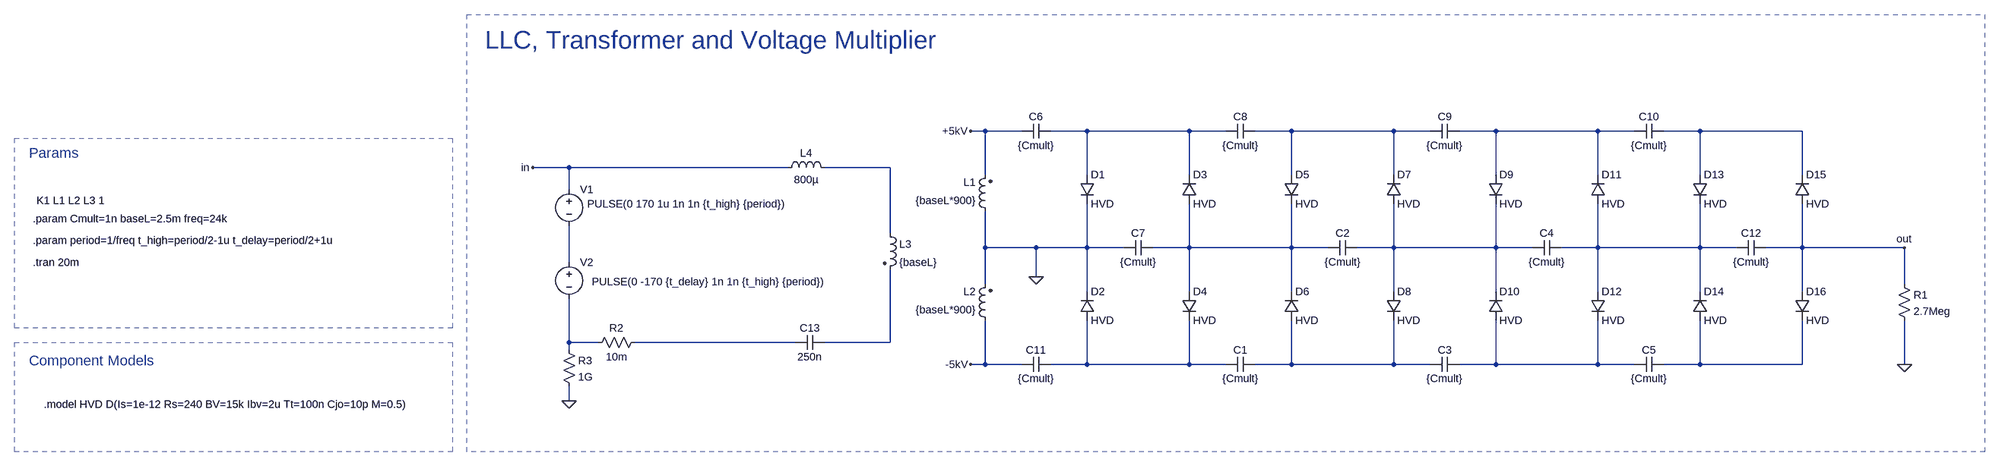
[diagram p0: schematic LLC_Multiplier_tran.asc]
LLC_Multiplier_tran.asc, the LTspice schematic file:
Version 4.1
SHEET 1 1844 1108
WIRE -352 -32 -384 -32
WIRE -272 -32 -352 -32
WIRE -128 -32 -208 -32
WIRE 96 -32 -128 -32
WIRE 176 -32 96 -32
WIRE 320 -32 240 -32
WIRE 544 -32 320 -32
WIRE 624 -32 544 -32
WIRE 768 -32 688 -32
WIRE 992 -32 768 -32
WIRE 1072 -32 992 -32
WIRE 1216 -32 1136 -32
WIRE 1440 -32 1216 -32
WIRE -1264 48 -1344 48
WIRE -784 48 -1264 48
WIRE -560 48 -704 48
WIRE -352 64 -352 -32
WIRE -128 64 -128 -32
WIRE 96 64 96 -32
WIRE 320 64 320 -32
WIRE 544 64 544 -32
WIRE 768 64 768 -32
WIRE 992 64 992 -32
WIRE 1216 64 1216 -32
WIRE 1440 64 1440 -32
WIRE -1264 96 -1264 48
WIRE -560 192 -560 48
WIRE -352 224 -352 144
WIRE -240 224 -352 224
WIRE -128 224 -128 128
WIRE -128 224 -240 224
WIRE -48 224 -128 224
WIRE 96 224 96 128
WIRE 96 224 16 224
WIRE 320 224 320 128
WIRE 320 224 96 224
WIRE 400 224 320 224
WIRE 544 224 544 128
WIRE 544 224 464 224
WIRE 768 224 768 128
WIRE 768 224 544 224
WIRE 848 224 768 224
WIRE 992 224 992 128
WIRE 992 224 912 224
WIRE 1216 224 1216 128
WIRE 1216 224 992 224
WIRE 1296 224 1216 224
WIRE 1440 224 1440 128
WIRE 1440 224 1360 224
WIRE 1664 224 1440 224
WIRE -1264 256 -1264 176
WIRE -240 288 -240 224
WIRE -352 304 -352 224
WIRE 1664 304 1664 224
WIRE -128 320 -128 224
WIRE 96 320 96 224
WIRE 320 320 320 224
WIRE 544 320 544 224
WIRE 768 320 768 224
WIRE 992 320 992 224
WIRE 1216 320 1216 224
WIRE 1440 320 1440 224
WIRE -1264 432 -1264 336
WIRE -1200 432 -1264 432
WIRE -768 432 -1120 432
WIRE -560 432 -560 272
WIRE -560 432 -704 432
WIRE -1264 448 -1264 432
WIRE -352 480 -352 384
WIRE -352 480 -384 480
WIRE -272 480 -352 480
WIRE -128 480 -128 384
WIRE -128 480 -208 480
WIRE 96 480 96 384
WIRE 96 480 -128 480
WIRE 176 480 96 480
WIRE 320 480 320 384
WIRE 320 480 240 480
WIRE 544 480 544 384
WIRE 544 480 320 480
WIRE 624 480 544 480
WIRE 768 480 768 384
WIRE 768 480 688 480
WIRE 992 480 992 384
WIRE 992 480 768 480
WIRE 1072 480 992 480
WIRE 1216 480 1216 384
WIRE 1216 480 1136 480
WIRE 1440 480 1440 384
WIRE 1440 480 1216 480
WIRE 1664 480 1664 384
WIRE -1264 560 -1264 528
FLAG 1664 480 0
FLAG -240 288 0
FLAG -1344 48 in
FLAG 1664 224 out
FLAG -1264 560 0
FLAG -384 -32 +5kV
FLAG -384 480 -5kV
SYMBOL cap 240 464 R90
WINDOW 0 0 32 VBottom 2
WINDOW 3 32 32 VTop 2
SYMATTR InstName C1
SYMATTR Value {Cmult}
SYMBOL cap 464 240 M270
WINDOW 0 32 32 VTop 2
WINDOW 3 0 32 VBottom 2
SYMATTR InstName C2
SYMATTR Value {Cmult}
SYMBOL cap 688 464 R90
WINDOW 0 0 32 VBottom 2
WINDOW 3 32 32 VTop 2
SYMATTR InstName C3
SYMATTR Value {Cmult}
SYMBOL res 1648 288 R0
SYMATTR InstName R1
SYMATTR Value 2.7Meg
SYMBOL cap 912 240 M270
WINDOW 0 32 32 VTop 2
WINDOW 3 0 32 VBottom 2
SYMATTR InstName C4
SYMATTR Value {Cmult}
SYMBOL cap 1136 464 R90
WINDOW 0 0 32 VBottom 2
WINDOW 3 32 32 VTop 2
SYMATTR InstName C5
SYMATTR Value {Cmult}
SYMBOL cap -272 -16 R270
WINDOW 0 32 32 VTop 2
WINDOW 3 0 32 VBottom 2
SYMATTR InstName C6
SYMATTR Value {Cmult}
SYMBOL cap 16 208 R90
WINDOW 0 0 32 VBottom 2
WINDOW 3 32 32 VTop 2
SYMATTR InstName C7
SYMATTR Value {Cmult}
SYMBOL cap 240 -48 R90
WINDOW 0 0 32 VBottom 2
WINDOW 3 32 32 VTop 2
SYMATTR InstName C8
SYMATTR Value {Cmult}
SYMBOL cap 688 -48 R90
WINDOW 0 0 32 VBottom 2
WINDOW 3 32 32 VTop 2
SYMATTR InstName C9
SYMATTR Value {Cmult}
SYMBOL cap 1136 -48 R90
WINDOW 0 0 32 VBottom 2
WINDOW 3 32 32 VTop 2
SYMATTR InstName C10
SYMATTR Value {Cmult}
SYMBOL cap -272 496 R270
WINDOW 0 32 32 VTop 2
WINDOW 3 0 32 VBottom 2
SYMATTR InstName C11
SYMATTR Value {Cmult}
SYMBOL cap 1360 240 M270
WINDOW 0 32 32 VTop 2
WINDOW 3 0 32 VBottom 2
SYMATTR InstName C12
SYMATTR Value {Cmult}
SYMBOL ind2 -336 160 R180
WINDOW 0 36 80 Left 2
WINDOW 3 36 40 Left 2
SYMATTR InstName L1
SYMATTR Value {baseL*900}
SYMATTR Type ind
SYMBOL ind2 -336 400 R180
WINDOW 0 36 80 Left 2
WINDOW 3 36 40 Left 2
SYMATTR InstName L2
SYMATTR Value {baseL*900}
SYMATTR Type ind
SYMBOL ind2 -576 176 R0
SYMATTR InstName L3
SYMATTR Value {baseL}
SYMATTR Type ind
SYMATTR SpiceLine Rser=1
SYMBOL diode -144 64 R0
SYMATTR InstName D1
SYMATTR Value HVD
SYMBOL diode -144 384 M180
WINDOW 0 24 64 Left 2
WINDOW 3 24 0 Left 2
SYMATTR InstName D2
SYMATTR Value HVD
SYMBOL diode 80 128 M180
WINDOW 0 24 64 Left 2
WINDOW 3 24 0 Left 2
SYMATTR InstName D3
SYMATTR Value HVD
SYMBOL diode 80 320 R0
SYMATTR InstName D4
SYMATTR Value HVD
SYMBOL diode 304 64 R0
SYMATTR InstName D5
SYMATTR Value HVD
SYMBOL diode 304 384 M180
WINDOW 0 24 64 Left 2
WINDOW 3 24 0 Left 2
SYMATTR InstName D6
SYMATTR Value HVD
SYMBOL diode 528 128 M180
WINDOW 0 24 64 Left 2
WINDOW 3 24 0 Left 2
SYMATTR InstName D7
SYMATTR Value HVD
SYMBOL diode 528 320 R0
SYMATTR InstName D8
SYMATTR Value HVD
SYMBOL diode 752 64 R0
SYMATTR InstName D9
SYMATTR Value HVD
SYMBOL diode 752 384 M180
WINDOW 0 24 64 Left 2
WINDOW 3 24 0 Left 2
SYMATTR InstName D10
SYMATTR Value HVD
SYMBOL diode 976 128 M180
WINDOW 0 24 64 Left 2
WINDOW 3 24 0 Left 2
SYMATTR InstName D11
SYMATTR Value HVD
SYMBOL diode 976 320 R0
SYMATTR InstName D12
SYMATTR Value HVD
SYMBOL diode 1200 64 R0
SYMATTR InstName D13
SYMATTR Value HVD
SYMBOL diode 1200 384 M180
WINDOW 0 24 64 Left 2
WINDOW 3 24 0 Left 2
SYMATTR InstName D14
SYMATTR Value HVD
SYMBOL diode 1424 128 M180
WINDOW 0 24 64 Left 2
WINDOW 3 24 0 Left 2
SYMATTR InstName D15
SYMATTR Value HVD
SYMBOL diode 1424 320 R0
SYMATTR InstName D16
SYMATTR Value HVD
SYMBOL ind -800 64 R270
WINDOW 0 32 56 VTop 2
WINDOW 3 5 56 VBottom 2
SYMATTR InstName L4
SYMATTR Value 800µ
SYMATTR SpiceLine Rser=1m
SYMBOL cap -704 416 R90
WINDOW 0 0 32 VBottom 2
WINDOW 3 32 32 VTop 2
SYMATTR InstName C13
SYMATTR Value 250n
SYMBOL res -1104 416 R90
WINDOW 0 0 56 VBottom 2
WINDOW 3 32 56 VTop 2
SYMATTR InstName R2
SYMATTR Value 10m
SYMBOL voltage -1264 80 R0
WINDOW 3 40 48 Left 2
WINDOW 123 0 0 Left 0
WINDOW 39 0 0 Left 0
SYMATTR Value PULSE(0 170 1u 1n 1n {t_high} {period})
SYMATTR InstName V1
SYMBOL res -1280 432 R0
SYMATTR InstName R3
SYMATTR Value 1G
SYMBOL voltage -1264 240 R0
WINDOW 3 50 59 Left 2
WINDOW 123 0 0 Left 0
WINDOW 39 0 0 Left 0
SYMATTR Value PULSE(0 -170 {t_delay} 1n 1n {t_high} {period})
SYMATTR InstName V2
TEXT -1448 -232 Left 5 ;LLC, Transformer and Voltage Multiplier
TEXT -2432 120 Left 2 !K1 L1 L2 L3 1
TEXT -2440 160 Left 2 !.param Cmult=1n baseL=2.5m freq=24k
TEXT -2416 568 Left 2 !.model HVD D(Is=1e-12 Rs=240 BV=15k Ibv=2u Tt=100n Cjo=10p M=0.5)
TEXT -2448 16 Left 3 ;Params
TEXT -2448 472 Left 3 ;Component Models
TEXT -2440 256 Left 2 !.tran 20m
TEXT -2440 208 Left 2 !.param period=1/freq t_high=period/2-1u t_delay=period/2+1u
RECTANGLE Normal -1520 400 -2480 -16 1
RECTANGLE Normal 1840 672 -1488 -288 1
RECTANGLE Normal -1520 672 -2480 432 1

The netlist it stands for:
* LLC_Multiplier_tran.asc
C1 N014 N013 {Cmult}
C2 N007 N006 {Cmult}
C3 N015 N014 {Cmult}
R1 out 0 2.7Meg
C4 N008 N007 {Cmult}
C5 N016 N015 {Cmult}
C6 +5kV N001 {Cmult}
C7 N006 0 {Cmult}
C8 N002 N001 {Cmult}
C9 N003 N002 {Cmult}
C10 N004 N003 {Cmult}
C11 -5kV N013 {Cmult}
C12 out N008 {Cmult}
L1 0 +5kV {baseL*900}
L2 -5kV 0 {baseL*900}
L3 N005 N012 {baseL} Rser=1
D1 N001 0 HVD
D2 N013 0 HVD
D3 N006 N001 HVD
D4 N006 N013 HVD
D5 N002 N006 HVD
D6 N014 N006 HVD
D7 N007 N002 HVD
D8 N007 N014 HVD
D9 N003 N007 HVD
D10 N015 N007 HVD
D11 N008 N003 HVD
D12 N008 N015 HVD
D13 N004 N008 HVD
D14 N016 N008 HVD
D15 out N004 HVD
D16 out N016 HVD
L4 in N005 800µ Rser=1m
C13 N012 N011 250n
R2 N011 N010 10m
V1 in N009 PULSE(0 170 1u 1n 1n {t_high} {period})
R3 N010 0 1G
V2 N009 N010 PULSE(0 -170 {t_delay} 1n 1n {t_high} {period})
.model D D
.lib standard.dio
* LLC, Transformer and Voltage Multiplier
K1 L1 L2 L3 1
.param Cmult=1n baseL=2.5m freq=24k
.model HVD D(Is=1e-12 Rs=240 BV=15k Ibv=2u Tt=100n Cjo=10p M=0.5)
* Params
* Component Models
.tran 20m
.param period=1/freq t_high=period/2-1u t_delay=period/2+1u
.backanno
.end